# EAGLE design haccess-v1 (EAGLE 6.5.0)
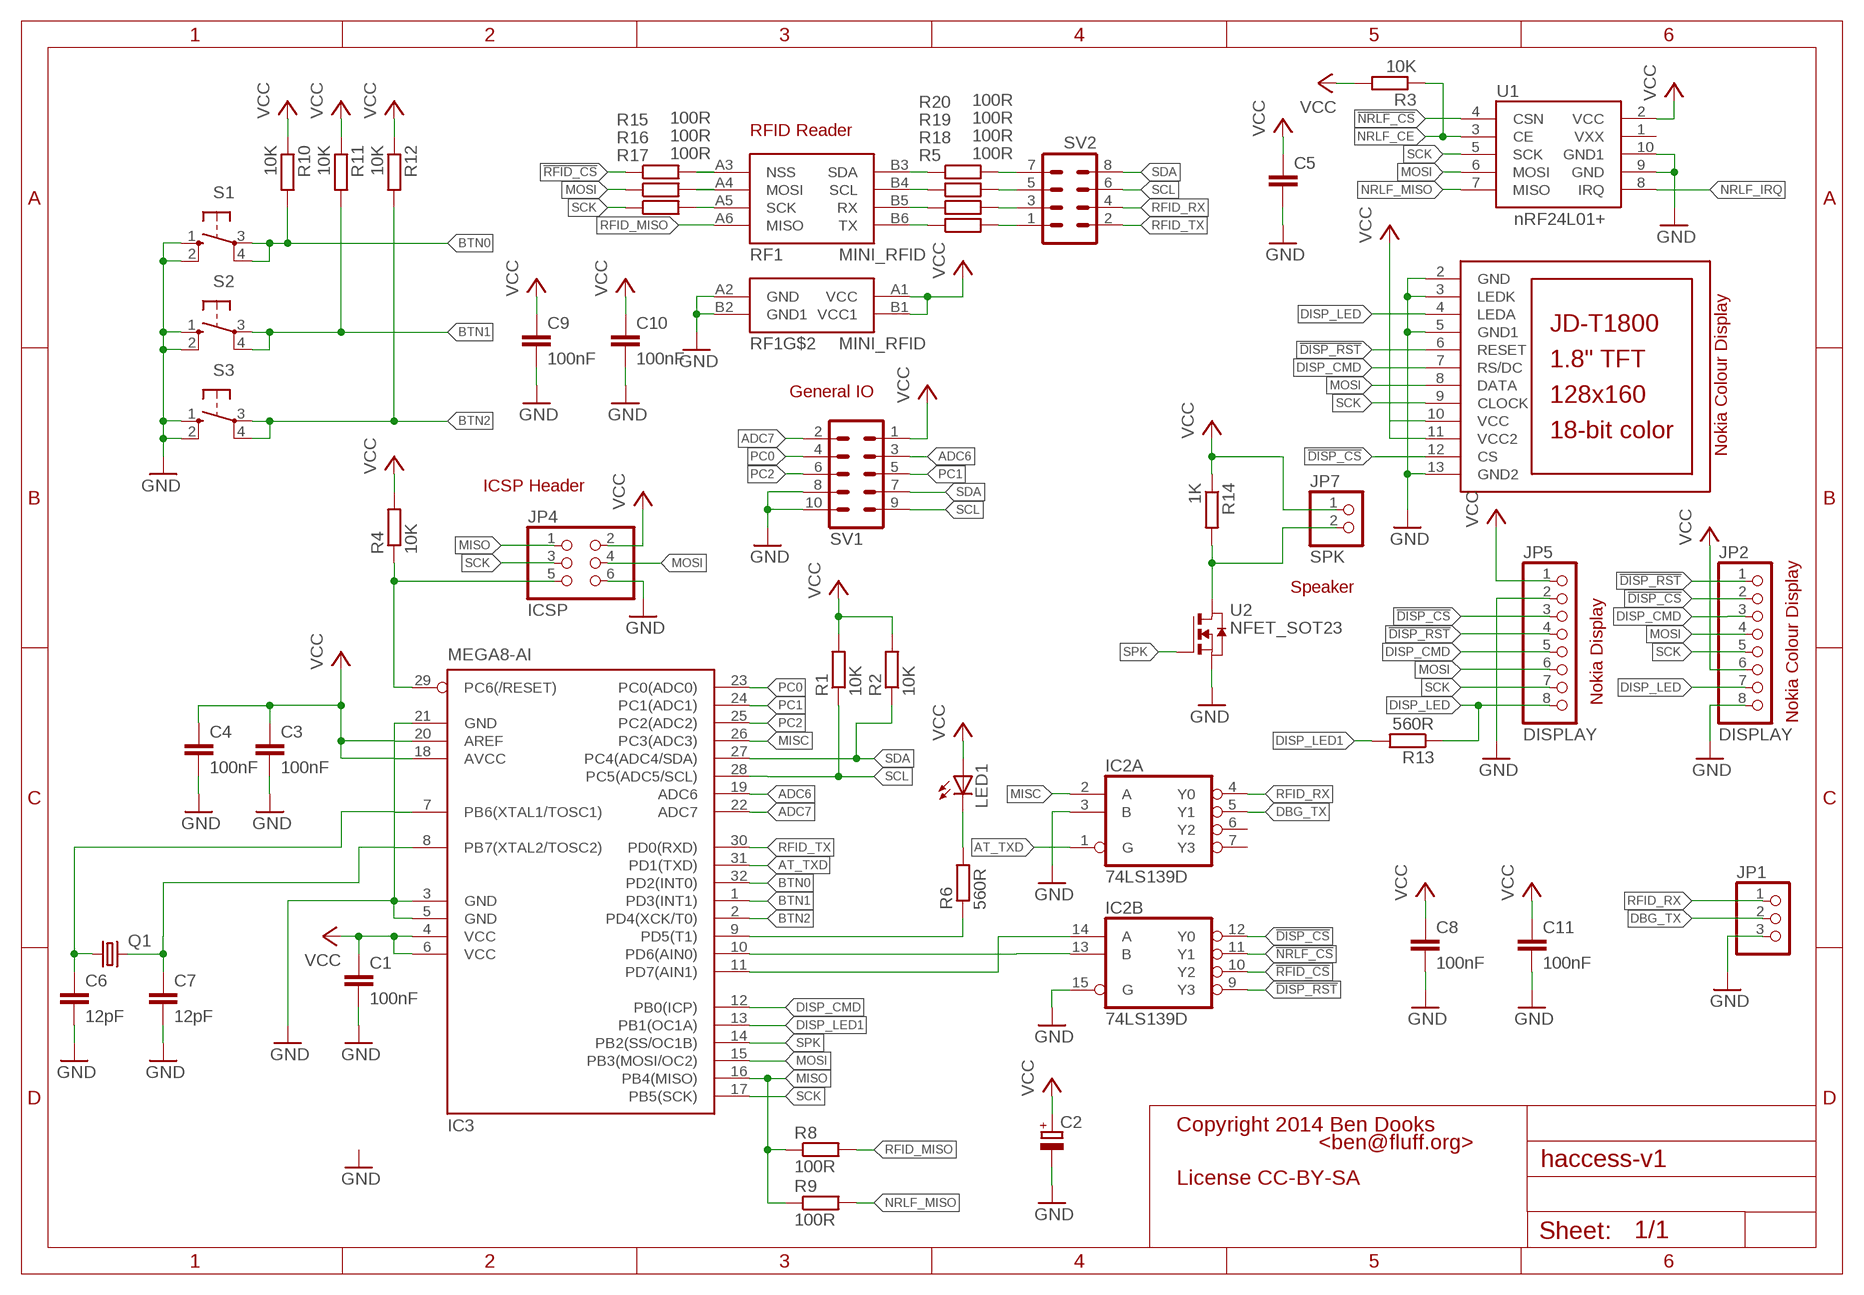
[diagram p0: schematic, sheet 1]

## Parts
C1  100nF  C-EU025-030X050  [C025-030X050]
C2  CPOL-EUE2.5-6  [E2,5-6]
C3  100nF  C-EUC0603K  [C0603K]
C4  100nF  C-EUC0603K  [C0603K]
C5  C-EU025-030X050  [C025-030X050]
C6  12pF  C-EUC0603K  [C0603K]
C7  12pF  C-EUC0603K  [C0603K]
C8  100nF  C-EUC0603K  [C0603K]
C9  100nF  C-EU025-030X050  [C025-030X050]
C10  100nF  C-EU025-030X050  [C025-030X050]
C11  100nF  C-EUC0603K  [C0603K]
IC2  74LS139D  [SO16]
IC3  MEGA8-AI  [TQFP32-08]
JP1  PINHD-1X3  [1X03]
JP2  DISPLAY  PINHD-1X8  [1X08]
JP4  ICSP  PINHD-2X3  [2X03]
JP5  DISPLAY  PINHD-1X8  [1X08]
JP7  SPK  PINHD-1X2  [1X02]
LCD1  JD-T1800  [JD-T1800]
LED1  LED5MM  [LED5MM]
Q1  CRYSTALHC49S  [HC49/S]
R1  10K  R-EU_R0603  [R0603]
R2  10K  R-EU_R0603  [R0603]
R3  10K  R-EU_R0603  [R0603]
R4  10K  R-EU_R0603  [R0603]
R5  100R  R-EU_R0603  [R0603]
R6  560R  R-EU_R0603  [R0603]
R8  100R  R-EU_0204/7  [0204/7]
R9  100R  R-EU_0204/7  [0204/7]
R10  10K  R-EU_R0603  [R0603]
R11  10K  R-EU_R0603  [R0603]
R12  10K  R-EU_R0603  [R0603]
R13  560R  R-EU_0204/7  [0204/7]
R14  1K  R-EU_R0603  [R0603]
R15  100R  R-EU_0207/10  [0207/10]
R16  100R  R-EU_0207/10  [0207/10]
R17  100R  R-EU_0207/7  [0207/7]
R18  100R  R-EU_R0603  [R0603]
R19  100R  R-EU_R0603  [R0603]
R20  100R  R-EU_R0603  [R0603]
RF1  MINI_RFID  [MINI_RFID]
S1  10-XX  [B3F-10XX]
S2  10-XX  [B3F-10XX]
S3  10-XX  [B3F-10XX]
SV1  MA05-2  [MA05-2]
SV2  MA04-2  [MA04-2]
U1  NRF24L01+CHINESE-10PIN  [CHINESE-10PIN]
U2  NFET_SOT23  [SOT23]

## Nets
!DISP_CS: IC2.12(B:Y0) JP2.2 JP5.3 LCD1.12(CS)
!DISP_RST: IC2.9(B:Y3) JP2.1 JP5.4 LCD1.6(RESET)
!NRLF_CS: IC2.11(B:Y1) U1.4(CSN)
!RESET: IC3.29(PC6(/RESET)) JP4.5 R4.1
!RFID_CS: IC2.10(B:Y2) R15.1
ADC6: IC3.19(ADC6) SV1.3
ADC7: IC3.22(ADC7) SV1.2
AT_TXD: IC2.1(A:G) IC3.31(PD1(TXD))
BTN0: IC3.32(PD2(INT0)) R10.2 S1.3(P) S1.4(P1)
BTN1: IC3.1(PD3(INT1)) R11.2 S2.3(P) S2.4(P1)
BTN2: IC3.2(PD4(XCK/T0)) R12.2 S3.3(P) S3.4(P1)
DBG_TX: IC2.5(A:Y1) JP1.2
DISP_CMD: IC3.12(PB0(ICP)) JP2.3 JP5.5 LCD1.7(RS/DC)
DISP_LED: JP2.7 JP5.8 LCD1.4(LEDA) R13.1
DISP_LED1: IC3.13(PB1(OC1A)) R13.2
GND: C1.2 C2.- C3.2 C4.2 C5.2 C6.2 C7.2 C8.2 C9.2 C10.2 C11.2 IC2.3(A:B) IC2.15(B:G) IC3.3(GND) IC3.5(GND) IC3.21(GND) JP1.3 JP2.8 JP4.6 JP5.2 LCD1.2(GND) LCD1.3(LEDK) LCD1.5(GND1) LCD1.13(GND2) RF1.A2(GND) RF1.B2(GND1) S1.1(S) S1.2(S1) S2.1(S) S2.2(S1) S3.1(S) S3.2(S1) SV1.8 SV1.10 U1.9(GND) U1.10(GND1) U2.2(S)
LED: IC3.9(PD5(T1)) R6.1
LED1: LED1.K(C) R6.2
MISC: IC2.2(A:A) IC3.26(PC3(ADC3))
MISO: IC3.16(PB4(MISO)) JP4.1 R8.1 R9.1
MOSI: IC3.15(PB3(MOSI/OC2)) JP2.4 JP4.4 JP5.6 LCD1.8(DATA) R16.1 U1.6(MOSI)
N$1: R17.2 RF1.A5(SCK)
N$2: R16.2 RF1.A4(MOSI)
N$3: R15.2 RF1.A3(NSS)
N$4: R5.1 RF1.B6(TX)
N$8: R18.1 RF1.B5(RX)
N$9: R19.1 RF1.B4(SCL)
N$10: R20.1 RF1.B3(SDA)
N$11: R20.2 SV2.7
N$12: IC2.13(B:B) IC3.10(PD6(AIN0))
N$13: R19.2 SV2.5
N$14: IC2.14(B:A) IC3.11(PD7(AIN1))
N$15: R18.2 SV2.3
N$16: R5.2 SV2.1
NRLF_CE: R3.1 U1.3(CE)
NRLF_IRQ: U1.8(IRQ)
NRLF_MISO: R9.2 U1.7(MISO)
PC0: IC3.23(PC0(ADC0)) SV1.4
PC1: IC3.24(PC1(ADC1)) SV1.5
PC2: IC3.25(PC2(ADC2)) SV1.6
RFID_MISO: R8.2 RF1.A6(MISO)
RFID_RX: IC2.4(A:Y0) JP1.1 SV2.4
RFID_TX: IC3.30(PD0(RXD)) SV2.2
SCK: IC3.17(PB5(SCK)) JP2.5 JP4.3 JP5.7 LCD1.9(CLOCK) R17.1 U1.5(SCK)
SCL: IC3.28(PC5(ADC5/SCL)) R1.1 SV1.9 SV2.6
SDA: IC3.27(PC4(ADC4/SDA)) R2.1 SV1.7 SV2.8
SPK: IC3.14(PB2(SS/OC1B)) U2.1(G)
SPK1: JP7.2 R14.2 U2.3(D)
VCC: C1.1 C2.+ C3.1 C4.1 C5.1 C8.1 C9.1 C10.1 C11.1 IC3.4(VCC) IC3.6(VCC) IC3.18(AVCC) IC3.20(AREF) JP2.6 JP4.2 JP5.1 JP7.1 LCD1.10(VCC) LCD1.11(VCC2) LED1.A R1.2 R2.2 R3.2 R4.2 R10.1 R11.1 R12.1 R14.1 RF1.A1(VCC) RF1.B1(VCC1) SV1.1 U1.2(VCC)
XT1: C6.1 IC3.7(PB6(XTAL1/TOSC1)) Q1.1
XT2: C7.1 IC3.8(PB7(XTAL2/TOSC2)) Q1.2
Unconnected: IC2.6(A:Y2) IC2.7(A:Y3) U1.1(VXX)

## Notes on the sheet
- RFID Reader
- General IO
- Nokia Colour Display
- ICSP Header
- Speaker
- Nokia Display
- Nokia Colour Display
- Copyright 2014 Ben Dooks
- <ben@fluff.org>
- License CC-BY-SA

## Power pins joined to a net without a drawn wire
GND: IC2.8(P:GND)
VCC: IC2.16(P:VCC)

## Library data of the parts
C1 C3-C11 = rcl:C-EU: CAPACITOR, European symbol
C2 = rcl:CPOL-EU: POLARIZED CAPACITOR, European symbol
IC2 = bjd-74us-tssops:74*139: Dual 2-line to 4-line DECODER/DEMULTIPLEXER
IC3 = atmel:MEGA8: MICROCONTROLLER 8 Kbytes FLASH, 1 kbytes SRAM, 512 bytes EEPROM, USART, 6-channel 10 bit ADC, 2-channel 8 bit ADC Pin compatible with Atmega48, ATMega88, ATMega168 Source: avr.lbr; MPN: ATMEGA8-16AU; OC_FARNELL: 9171371; OC_NEWARK: 73M8863
JP1 = adafruit:PINHD-1X3: PIN HEADER
JP2 JP5 = pinhead:PINHD-1X8: PIN HEADER
JP4 = pinhead:PINHD-2X3: PIN HEADER
JP7 = pinhead:PINHD-1X2: PIN HEADER
LCD1 = adafruit:JD-T1800
LED1 = led:LED: LED OSRAM: - CHIPLED LG R971, LG N971, LY N971, LG Q971, LY Q971, LO R971, LY R971 LH N974, LH R974 LS Q976, LO Q976, LY Q976 LO Q996 - Hyper CHIPLED LW Q18S LB Q993, LB Q99A, LB R99A - SideLED LS A670, LO A670, LY A670, LG A670, LP A670 LB A673, LV A673, LT A673, LW A673 LH A674 LY A675 LS A676, LA A676, LO A676, LY A676, LW A676 LS A679, LY A679, LG A679 - Hyper Micro SIDELED® LS Y876, LA Y876, LO Y876, LY Y876 LT Y87S - SmartLED LW L88C, LW L88S LB L89C, LB L89S, LG L890 LS L89K, LO L89K, LY L89K LS L896, LA L896, LO L896, LY L896 - TOPLED LS T670, LO T670, LY T670, LG T670, LP T670 LSG T670, LSP T670, LSY T670, LOP T670, LYG T670 LG T671, LOG T671, LSG T671 LB T673, LV T673, LT T673, LW T673 LH T674 LS T676, LA T676, LO T676, LY T676, LB T676, LH T676, LSB T676, LW T676 LB T67C, LV T67C, LT T67C, LS T67K, LO T67K, LY T67K, LW E67C LS E67B, LA E67B, LO E67B, LY E67B, LB E67C, LV E67C, LT E67C LW T67C LS T679, LY T679, LG T679 LS T770, LO T770, LY T770, LG T770, LP T770 LB T773, LV T773, LT T773, LW T773 LH T774 LS E675, LA E675, LY E675, LS T675 LS T776, LA T776, LO T776, LY T776, LB T776 LHGB T686 LT T68C, LB T68C - Hyper Mini TOPLED® LB M676 - Mini TOPLED Santana® LG M470 LS M47K, LO M47K, LY M47K Source: http://www.osram.convergy.de LUXEON: - LUMILED® LXK2-PW12-R00, LXK2-PW12-S00, LXK2-PW14-U00, LXK2-PW14-V00 LXK2-PM12-R00, LXK2-PM12-S00, LXK2-PM14-U00 LXK2-PE12-Q00, LXK2-PE12-R00, LXK2-PE12-S00, LXK2-PE14-T00, LXK2-PE14-U00 LXK2-PB12-K00, LXK2-PB12-L00, LXK2-PB12-M00, LXK2-PB14-N00, LXK2-PB14-P00, LXK2-PB14-Q00 LXK2-PR12-L00, LXK2-PR12-M00, LXK2-PR14-Q00, LXK2-PR14-R00 LXK2-PD12-Q00, LXK2-PD12-R00, LXK2-PD12-S00 LXK2-PH12-R00, LXK2-PH12-S00 LXK2-PL12-P00, LXK2-PL12-Q00, LXK2-PL12-R00 Source: www.luxeon.com KINGBRIGHT: KA-3528ASYC Source: www.kingbright.com
Q1 = bjd-crystals:CRYSTAL: CRYSTAL
R1-R6 R8-R20 = rcl:R-EU_: RESISTOR, European symbol
RF1 = bjd-mini-rfid:MINI_RFID
S1-S3 = switch-omron:10-XX: OMRON SWITCH; MPN: B3F-1000; OC_FARNELL: 176432; OC_NEWARK: 36M3542
SV1 = con-lstb:MA05-2: PIN HEADER; OC_FARNELL: unknown; OC_NEWARK: unknown
SV2 = con-lstb:MA04-2: PIN HEADER; OC_FARNELL: unknown; OC_NEWARK: unknown
U1 = bjd-nrlf24+:NRF24L01+: When using the DUAL version of this library, make sure to connect VXX to either GND or NC
U2 = bjd-generic-fets:NFET_SOT23

## Board
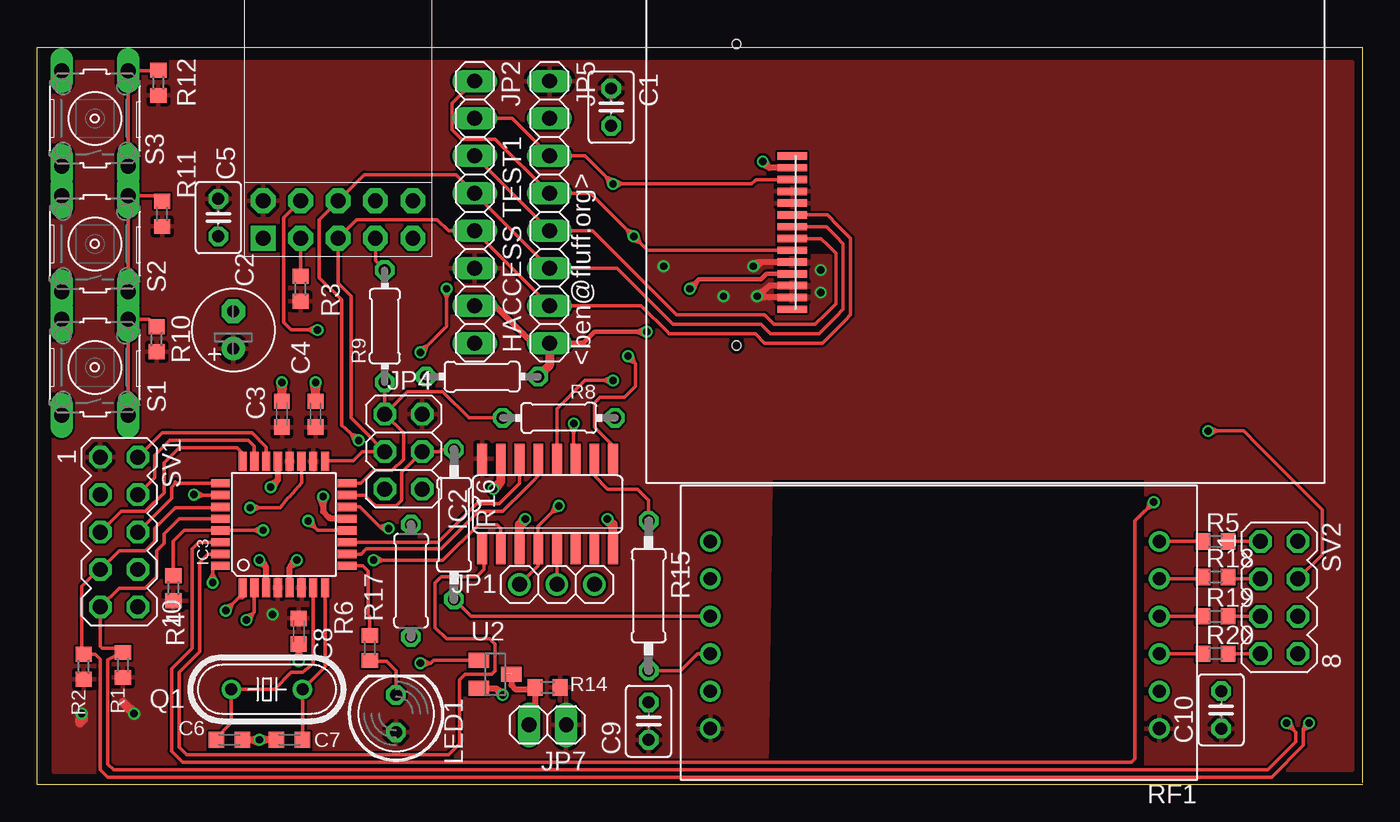
[diagram p1: board, top side]
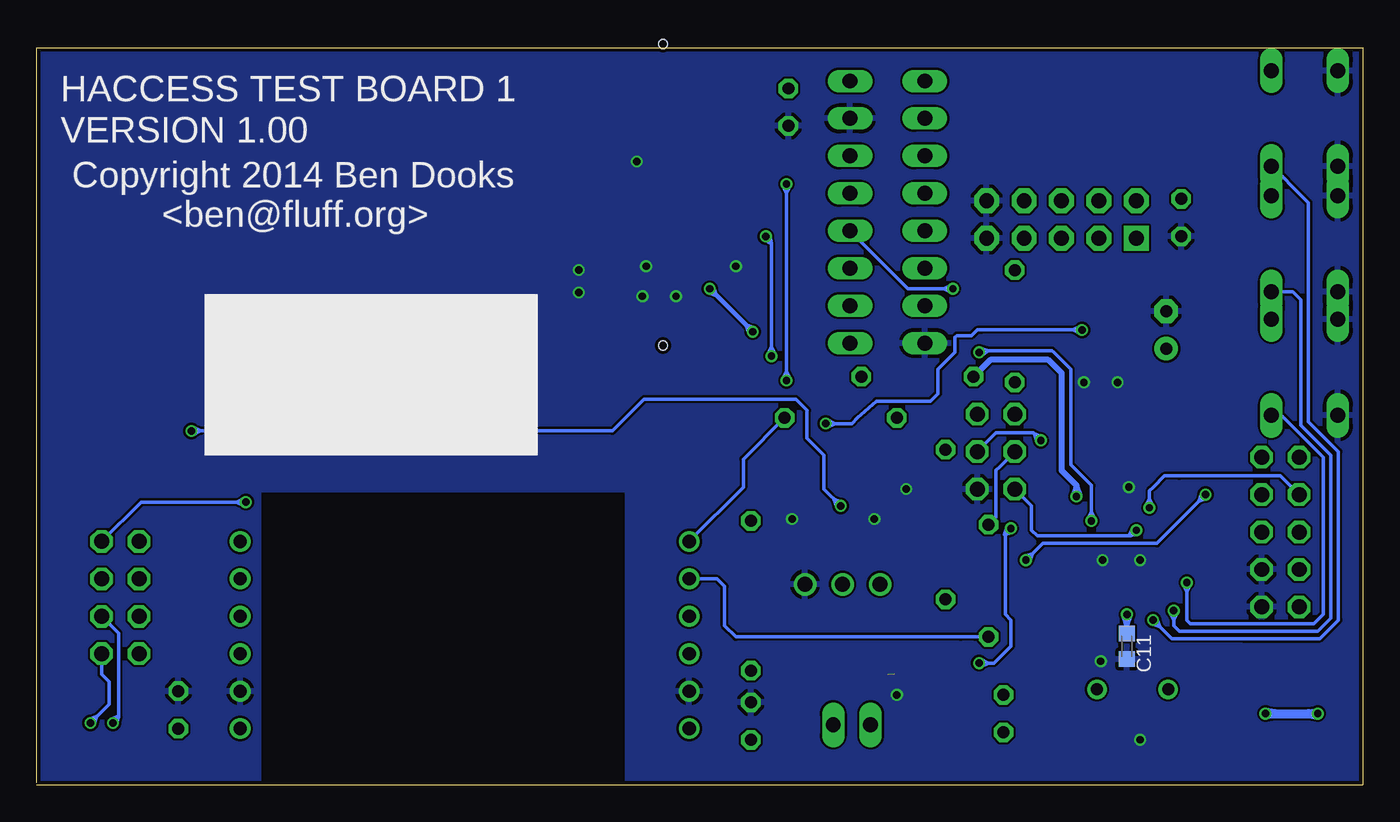
[diagram p2: board, bottom side, seen from below]

Size 90 x 50 mm. Coordinates in mm from the lower left corner, seen from the top.
Outline: 90,0.13 90,50 0,50 0,0 90,0
Copper layers (1*16): Top 0.035mm / dielectric 1.5mm / Bottom 0.035mm
Design rules "Elecrow_2-layer_eagle_rule *": minimum track width 6mil, minimum drill 12mil, track to track 6mil, track to pad 6mil, pad to pad 6mil, via to via 6mil, smd to smd 0mil, copper to edge 10mil, drill to drill 10mil, minimum pad ring 10mil, minimum via ring 6mil, stop-mask expansion 2mil, vias tented up to drill 100mil, thermal gap 10mil

### Footprints (pad centres in the part's own frame; a part is rotated, then mirrored left to right if it is on the bottom)
C025-030X050 = drill 0.813 octagon: 1 -1.27,0; 2 1.27,0
E2,5-6 = drill 0.813 pad 1.6: + -1.27,0 | drill 0.813 pad 1.6 octagon: - 1.27,0
C0603K = smd 1.05 x 1.08: 1 -0.875,0; 2 0.875,0
SO16 = smd 0.66 x 2.032: 1 -4.445,-3.073; 2 -3.175,-3.073; 3 -1.905,-3.073; 4 -0.635,-3.073; 5 0.635,-3.073; 6 1.905,-3.073; 7 3.175,-3.073; 8 4.445,-3.073; 9 4.445,3.073; 10 3.175,3.073; 11 1.905,3.073; 12 0.635,3.073; 13 -0.635,3.073; 14 -1.905,3.073; 15 -3.175,3.073; 16 -4.445,3.073
TQFP32-08 = smd 1.27 x 0.559: 1 -4.293,2.8; 2 -4.293,2; 3 -4.293,1.2; 4 -4.293,0.4; 5 -4.293,-0.4; 6 -4.293,-1.2; 7 -4.293,-2; 8 -4.293,-2.8; 17 4.293,-2.8; 18 4.293,-2; 19 4.293,-1.2; 20 4.293,-0.4; 21 4.293,0.4; 22 4.293,1.2; 23 4.293,2; 24 4.293,2.8 | smd 0.559 x 1.27: 9 -2.8,-4.293; 10 -2,-4.293; 11 -1.2,-4.293; 12 -0.4,-4.293; 13 0.4,-4.293; 14 1.2,-4.293; 15 2,-4.293; 16 2.8,-4.293; 25 2.8,4.293; 26 2,4.293; 27 1.2,4.293; 28 0.4,4.293; 29 -0.4,4.293; 30 -1.2,4.293; 31 -2,4.293; 32 -2.8,4.293
1X03 = drill 1.016: 1 -2.54,0; 2 0,0; 3 2.54,0
1X08 = drill 1.016 long: 1 -8.89,0; 2 -6.35,0; 3 -3.81,0; 4 -1.27,0; 5 1.27,0; 6 3.81,0; 7 6.35,0; 8 8.89,0
2X03 = drill 1.016 octagon: 1 -2.54,-1.27; 2 -2.54,1.27; 3 0,-1.27; 4 0,1.27; 5 2.54,-1.27; 6 2.54,1.27
1X02 = drill 1.016 long: 1 -1.27,0; 2 1.27,0
JD-T1800 = smd 0.5 x 2: 1 5.2,-13.1; 2 4.4,-13.1; 3 3.6,-13.1; 4 2.8,-13.1; 5 2,-13.1; 6 1.2,-13.1; 7 0.4,-13.1; 8 -0.4,-13.1; 9 -1.2,-13.1; 10 -2,-13.1; 11 -2.8,-13.1; 12 -3.6,-13.1; 13 -4.4,-13.1; 14 -5.2,-13.1 | hole 0.6: -12.8,-16.9; 7.65,-16.9
LED5MM = drill 0.813 octagon: A -1.27,0; K 1.27,0
HC49/S = drill 0.813: 1 -2.413,0; 2 2.413,0
R0603 = smd 1 x 1.1: 1 -0.85,0; 2 0.85,0
0204/7 = drill 0.813 octagon: 1 -3.81,0; 2 3.81,0
0207/10 = drill 0.813 octagon: 1 -5.08,0; 2 5.08,0
0207/7 = drill 0.813 octagon: 1 -3.81,0; 2 3.81,0
MINI_RFID = drill 0.9: A1 33.02,16.51; A2 33.02,13.97; A3 33.02,11.43; A4 33.02,8.89; A5 33.02,6.35; A6 33.02,3.81; B1 2.54,16.51; B2 2.54,13.97; B3 2.54,11.43; B4 2.54,8.89; B5 2.54,6.35; B6 2.54,3.81
B3F-10XX = drill 1.016 long: 1 -3.251,2.261; 2 3.251,2.261; 3 -3.251,-2.261; 4 3.251,-2.261
MA05-2 = drill 1.016 octagon: 1 -5.08,-1.27; 2 -5.08,1.27; 3 -2.54,-1.27; 4 -2.54,1.27; 5 0,-1.27; 6 0,1.27; 7 2.54,-1.27; 8 2.54,1.27; 9 5.08,-1.27; 10 5.08,1.27
MA04-2 = drill 1.016 octagon: 1 -3.81,-1.27; 2 -3.81,1.27; 3 -1.27,-1.27; 4 -1.27,1.27; 5 1.27,-1.27; 6 1.27,1.27; 7 3.81,-1.27; 8 3.81,1.27
CHINESE-10PIN = drill 1 pad 1.676 square: 1 -1.27,2.54 | drill 1 pad 1.676 octagon: 2 1.27,2.54; 3 -1.27,0; 4 1.27,0; 5 -1.27,-2.54; 6 1.27,-2.54; 7 -1.27,-5.08; 8 1.27,-5.08; 9 -1.27,-7.62; 10 1.27,-7.62
SOT23 = smd 1 x 1.4: 1 -0.95,-1.1; 2 0.95,-1.1; 3 0,1.1

### Placement (x,y rotation side)
C1  38.99,45.97 270 top
C2  13.34,30.86 90 top
C3  16.64,25.15 90 top
C4  18.92,25.15 90 top
C5  12.32,38.48 270 top
C6  13.08,3.05 0 top
C7  17.14,3.05 180 top
C8  17.78,10.41 270 top
C9  41.53,4.32 90 top
C10  80.39,5.08 90 top
C11  16,9.4 270 bottom
IC2  34.67,19.05 0 top
IC3  16.76,17.65 90 top
JP1  35.31,13.59 0 top
JP2  29.72,38.86 270 top
JP4  24.89,22.61 270 top
JP5  34.8,38.86 270 top
JP7  34.67,4.06 180 top
LCD1  64.39,37.47 270 top
LED1  24.38,4.83 90 top
Q1  15.62,6.48 0 top
R1  5.84,8.13 270 top
R2  3.17,8 270 top
R3  17.91,33.66 270 top
R4  9.27,13.34 270 top
R5  80.01,16.51 0 top
R6  22.61,9.27 270 top
R8  35.43,24.89 0 top
R9  23.62,31.11 90 top
R10  8.13,30.23 90 top
R11  8.51,38.73 90 top
R12  8.26,47.62 90 top
R13  30.23,27.69 180 top
R14  34.67,6.6 180 top
R15  41.53,12.83 270 top
R16  28.32,17.65 270 top
R17  25.4,13.84 270 top
R18  80.01,14.1 0 top
R19  80.01,11.43 0 top
R20  80.01,8.89 0 top
RF1  78.74,20.32 180 top
S1  3.94,28.32 90 top
S2  3.94,36.7 90 top
S3  3.94,45.21 90 top
SV1  5.59,17.14 270 top
SV2  84.33,12.7 270 top
U1  17.91,38.35 90 top
U2  31.11,7.49 270 top

### Tracks (layer width: path | path; a pad name or v marks a point on that pad's centre or on a via)
!DISP_CS  (via drill 0.5)
  Top 0.254: JP2.2 32.26,45.21 JP5.3 37.21,42.67 38.73,41.15 v39.12,40.77 | v39.12,40.77 39.62,40.77 | 39.62,40.77 48.51,40.77 48.77,41.02 48.85,41.06 LCD1.12 | v39.12,40.77 39.62,40.77 | IC2.12 35.31,25.53 37.21,27.43 v39.12,27.43 | v39.12,27.43 38.99,27.18 38.49,27.43 38.99,27.68 v39.12,27.43 | v39.12,40.77 38.85,40.68 38.67,41.21 39.2,41.03 v39.12,40.77 | v39.12,40.77 39.24,41.01 39.74,40.77 39.24,40.52 v39.12,40.77
  Bottom 0.254: v39.12,27.43 v39.12,40.77 | v39.12,27.43 38.87,27.55 39.12,28.06 39.36,27.55 v39.12,27.43 | v39.12,40.77 39.36,40.65 39.12,40.14 38.87,40.65 v39.12,40.77
!DISP_RST  (via drill 0.5)
  Top 0.254: LCD1.6 41.46,36.27 v40.51,37.21 | v40.51,37.21 37.59,40.13 JP5.4 31.11,43.81 28.83,43.81 28.19,44.45 28.19,46.23 JP2.1 | IC2.9 39.12,22.99 38.35,23.75 37.85,24.26 37.85,25.91 38.23,26.29 39.88,26.29 40.64,27.05 40.64,28.57 v40.13,29.08 | v40.13,29.08 40.39,29.17 40.57,28.64 40.04,28.82 v40.13,29.08 | v40.51,37.21 40.77,37.3 40.95,36.77 40.42,36.95 v40.51,37.21 | v40.51,37.21 40.25,37.12 40.07,37.65 40.6,37.47 v40.51,37.21
  Bottom 0.254: v40.13,29.08 40.13,29.46 40.13,36.2 40.13,36.7 v40.51,37.21 | v40.13,29.08 39.88,29.2 40.13,29.71 40.38,29.2 v40.13,29.08 | v40.51,37.21 40.64,36.97 40.14,36.71 40.24,37.26 v40.51,37.21
!NRLF_CS  (via drill 0.5)
  Top 0.254: U1.4 16.76,38.48 16.76,31.37 17.27,30.86 v19.05,30.86 | IC2.11 36.58,22.99 36.45,23.11 36.45,23.5 v36.45,24.51 | v19.05,30.86 18.93,30.61 18.43,30.86 18.93,31.11 v19.05,30.86 | v36.45,24.51 36.7,24.39 36.45,23.89 36.2,24.39 v36.45,24.51
  Bottom 0.254: v19.05,30.86 25.91,30.86 26.16,30.86 26.29,30.73 26.54,30.48 27.56,30.48 27.69,30.35 27.69,29.34 28.83,28.19 28.83,26.92 28.83,26.54 29.34,26.04 33.02,26.04 34.29,24.89 34.67,24.51 v36.45,24.51 | v19.05,30.86 19.17,31.11 19.68,30.86 19.17,30.61 v19.05,30.86 | v36.45,24.51 36.33,24.26 35.82,24.51 36.33,24.76 v36.45,24.51
!RESET  (via drill 0.5)
  Top 0.254: v15.37,17.27 14.61,17.27 14.59,17.25 IC3.29 10.01,17.25 9.27,16.51 R4.1 | v15.37,17.27 15.25,17.02 14.74,17.27 15.25,17.52 v15.37,17.27
  Bottom 0.254: JP4.5 22.48,18.92 22.48,17.27 22.1,16.89 15.75,16.89 v15.37,17.27 | v15.37,17.27 15.61,17.39 15.86,16.89 15.31,17 v15.37,17.27
!RFID_CS
  Top 0.254: IC2.10 37.85,20.95 38.73,20.07 40.26,20.07 40.77,20.07 41.02,19.81 41.53,19.3 R15.1
ADC6  (via drill 0.5)
  Top 0.254: IC3.19 17.96,20.5 17.14,19.56 17.02,19.43 16.51,18.8 v14.48,18.8 | v14.48,18.8 14.6,19.04 15.1,18.8 14.6,18.55 v14.48,18.8
  Bottom 0.254: SV1.3 5.46,20.83 5.59,20.95 12.45,20.95 13.46,20.95 14.22,20.19 14.48,19.94 v14.48,18.8 | v14.48,18.8 14.23,18.92 14.48,19.42 14.72,18.92 v14.48,18.8
ADC7
  Top 0.254: IC3.22 15.56,22.92 14.61,23.88 9.14,23.88 8.51,23.88 SV1.2
AT_TXD
  Top 0.254: IC3.31 11.59,15.65 11.05,15.11 11.05,9.02 9.65,7.62 9.65,2.54 10.16,2.03 22.23,2.03 22.99,2.03 27.94,2.03 28.7,2.79 28.7,7.11 29.08,7.49 30.86,7.49 31.11,7.75 31.11,9.53 30.73,9.91 27.81,9.91 27.05,10.67 27.05,13.72 27.43,14.1 29.84,14.1 30.35,14.61 30.35,15.85 IC2.1
BTN0  (via drill 0.5)
  Top 0.254: R10.2 7.63,31.57 S1.4 S1.3 | v11.94,13.72 11.94,14.7 IC3.32 | v11.94,13.72 11.69,13.84 11.94,14.34 12.19,13.84 v11.94,13.72
  Bottom 0.254: S1.3 5.51,25.07 2.67,22.23 2.67,11.56 3.3,10.92 11.68,10.92 11.94,11.18 11.94,13.46 v11.94,13.72 | v11.94,13.72 12.19,13.6 11.94,13.09 11.69,13.6 v11.94,13.72
BTN1  (via drill 0.5)
  Top 0.254: R11.2 8.14,39.95 S2.4 S2.3 | v12.83,11.81 13.72,12.7 13.97,12.7 14.1,12.83 14.1,13.23 IC3.1 | v12.83,11.81 12.74,12.07 13.27,12.25 13.09,11.72 v12.83,11.81
  Bottom 0.254: S2.3 4.75,33.45 4.19,32.89 4.19,24.38 2.16,22.35 2.16,11.3 3.05,10.41 12.45,10.41 12.83,10.79 v12.83,11.81 | v12.83,11.81 13.07,11.69 12.83,11.19 12.58,11.69 v12.83,11.81
BTN2  (via drill 0.5)
  Top 0.254: R12.2 8.24,48.46 S3.4 S3.3 | IC3.2 14.76,11.72 14.35,11.3 v14.22,11.18 | v14.22,11.18 14.13,11.44 14.67,11.62 14.48,11.09 v14.22,11.18
  Bottom 0.254: v14.22,11.18 13.59,10.54 12.95,9.91 11.56,9.91 8.13,9.91 2.92,9.91 1.65,11.18 1.65,22.61 3.68,24.64 3.68,39.5 4.06,39.88 6.15,41.96 S3.3 | v14.22,11.18 14.31,10.91 13.78,10.73 13.96,11.27 v14.22,11.18
DBG_TX
  Top 0.254: IC2.5 JP1.2
DISP_CMD  (via drill 0.5)
  Top 0.254: JP2.3 JP5.5 37.72,37.59 43.43,31.88 49.15,31.88 49.4,31.88 49.78,31.5 50.04,31.24 52.83,31.24 53.59,32 54.23,32.64 54.23,36.07 54.1,36.2 53.59,36.7 53.34,36.96 53.23,37.06 LCD1.7 | IC3.12 19.07,17.25 18.67,17.65 v18.41,17.91 | v26.04,29.34 26.42,29.72 27.81,31.11 v27.81,33.66 | v18.41,17.91 18.68,18 18.86,17.46 18.33,17.65 v18.41,17.91 | v26.04,29.34 25.95,29.6 26.48,29.78 26.3,29.25 v26.04,29.34 | v27.81,33.66 28.06,33.53 27.81,33.03 27.57,33.53 v27.81,33.66
  Bottom 0.254: v18.41,17.91 18.41,20.32 19.81,21.72 19.81,28.19 20.95,29.34 21.08,29.46 25.65,29.46 v26.04,29.34 | v27.81,33.66 30.86,33.66 JP5.5 | v18.41,17.91 18.17,18.03 18.41,18.53 18.66,18.03 v18.41,17.91 | v26.04,29.34 25.87,29.12 25.42,29.46 25.97,29.6 v26.04,29.34 | v27.81,33.66 27.93,33.9 28.44,33.66 27.93,33.41 v27.81,33.66
DISP_LED  (via drill 0.5)
  Top 0.305: LCD1.4 49.52,34.66 49.4,34.54 49.15,34.29 44.96,34.29 v44.32,33.66 | v41.4,30.73 37.85,30.73 37.08,29.97 | v44.32,33.66 44.23,33.89 44.77,34.1 44.56,33.56 v44.32,33.66 | v41.4,30.73 41.3,30.5 40.78,30.73 41.3,30.96 v41.4,30.73
  Top 0.406: JP2.7 31.11,32.51 33.02,30.61 33.66,29.97 JP5.8 37.08,29.97
  Top 0.61: JP5.8 34.8,28.45 R13.1
  Bottom 0.305: v44.32,33.66 43.56,32.89 v41.4,30.73 | v44.32,33.66 44.41,33.42 43.88,33.21 44.09,33.75 v44.32,33.66 | v41.4,30.73 41.31,30.97 41.84,31.18 41.63,30.64 v41.4,30.73
DISP_LED1  (via drill 0.5)
  Top 0.406: v19.43,19.56 19.43,18.54 19.81,18.16 19.92,18.05 IC3.13 | v19.43,19.56 19.62,19.5 19.43,18.93 19.24,19.5 v19.43,19.56
  Bottom 0.406: v19.43,19.56 19.43,20.32 19.81,20.7 20.45,21.34 20.45,27.94 21.34,28.83 25.27,28.83 25.65,28.45 R13.2 | v19.43,19.56 19.24,19.62 19.43,20.18 19.62,19.62 v19.43,19.56
GND  (via drill 0.5)
  Top 0.406: IC3.3 15.56,14.79 v15.11,15.24 | IC3.5 17.16,14.75 v17.65,15.24 | IC3.21 16.36,20.68 v15.88,20.19 | U2.2 31.18,6.54 v31.62,6.1 | C6.2 v15.11,3.05 | C7.2 v15.11,3.05 | LCD1.13 49.7,41.87 v49.28,42.29 | LCD1.5 48.93,35.47 v48.64,35.18 | LCD1.3 49.74,33.87 v48.9,33.15 | LCD1.2 49.74,33.06 v48.9,33.15 | C8.2 v17.78,8.38 | v15.11,15.24 15.29,15.33 15.55,14.8 15.02,15.06 v15.11,15.24 | v17.65,15.24 17.74,15.06 17.21,14.8 17.48,15.33 v17.65,15.24 | v15.88,20.19 15.79,20.37 16.32,20.64 16.05,20.1 v15.88,20.19 | v31.62,6.1 31.45,6.01 31.18,6.54 31.71,6.27 v31.62,6.1 | v15.11,3.05 15.05,2.86 14.49,3.05 15.05,3.24 v15.11,3.05 | v15.11,3.05 15.18,3.24 15.74,3.05 15.18,2.86 v15.11,3.05 | v49.28,42.29 49.45,42.39 49.73,41.87 49.19,42.11 v49.28,42.29 | v48.64,35.18 48.61,35.38 49.2,35.47 48.78,35.04 v48.64,35.18 | v48.9,33.15 48.82,33.33 49.37,33.55 49.07,33.04 v48.9,33.15 | v48.9,33.15 48.98,33.33 49.52,33.09 48.94,32.95 v48.9,33.15 | v17.78,8.38 17.59,8.45 17.78,9.01 17.97,8.45 v17.78,8.38
  Top 0.61: C3.2 v16.64,27.3 | C4.2 v18.92,27.3 | IC2.3 32.77,17.65 v33.15,18.03 | IC2.15 31.5,20.57 v30.99,20.07 | IC2.8 39.12,17.65 v38.73,18.03 | v16.64,27.3 16.73,27.29 16.64,26.68 16.54,27.29 v16.64,27.3 | v18.92,27.3 19.02,27.29 18.92,26.68 18.83,27.29 v18.92,27.3 | v33.15,18.03 33.21,17.96 32.77,17.54 33.06,18.08 v33.15,18.03 | v30.99,20.07 30.93,20.14 31.43,20.51 31.07,20.01 v30.99,20.07 | v38.73,18.03 38.82,18.08 39.12,17.54 38.67,17.96 v38.73,18.03
  other vias: 46.61,33.15 42.55,35.18 53.21,34.92 53.21,33.4
  pour Bottom: -0.25,50.16 92.84,50.16 92.33,-1.02 74.93,-1.14 74.93,20.07 49.91,20.07 49.91,0 0,0
  pour Top: 41.66,35.81 53.85,35.81 53.85,31.37 41.66,31.37
LED
  Top 0.254: IC3.9 22.1,14.85 22.48,14.48 22.48,11.56 22.61,11.43 R6.1
LED1
  Top 0.254: LED1.K 24.38,7.75 23.75,8.38 22.64,8.38 R6.2
MISC  (via drill 0.5)
  Top 0.254: IC3.26 10.7,19.65 v10.67,19.68 | v22.86,15.24 27.56,15.24 29.97,17.65 31.24,17.65 31.5,17.4 IC2.2 | v10.67,19.68 10.8,19.93 11.29,19.65 10.78,19.43 v10.67,19.68 | v22.86,15.24 22.98,15.49 23.48,15.24 22.98,14.99 v22.86,15.24
  Bottom 0.254: v10.67,19.68 11.05,19.3 13.97,16.38 21.72,16.38 v22.86,15.24 | v10.67,19.68 10.93,19.77 11.11,19.24 10.58,19.42 v10.67,19.68 | v22.86,15.24 22.6,15.15 22.42,15.68 22.95,15.5 v22.86,15.24
MISO
  Top 0.254: IC3.16 21.98,20.45 22.86,21.34 24.13,21.34 24.89,22.1 24.89,23.88 JP4.1 | JP4.1 R9.1 | R8.1 29.34,24.89 27.56,26.67 25.15,26.67 JP4.1
MOSI  (via drill 0.5)
  Top 0.254: LCD1.8 53.58,37.87 53.59,37.85 54.23,37.21 54.74,36.7 54.74,32.26 54.23,31.75 53.09,30.61 49.78,30.61 49.15,31.24 48.77,31.24 43.18,31.24 39.37,35.05 JP5.6 JP2.4 28.45,41.4 22.23,41.4 U1.6 19.18,38.35 19.18,34.42 20.7,32.89 20.7,24.38 v21.84,23.37 | R16.1 27.43,22.73 27.3,22.61 JP4.4 24.77,21.21 24.77,19.3 24.64,19.18 24.38,18.92 22.99,18.92 22.73,19.18 22.26,19.65 IC3.15 | v21.84,23.37 21.59,23.26 21.38,23.78 21.92,23.63 v21.84,23.37
  Bottom 0.254: JP4.4 25.27,23.5 24.89,23.88 22.35,23.88 v21.84,23.37 | v21.84,23.37 21.75,23.63 22.29,23.81 22.11,23.28 v21.84,23.37
N$1
  Bottom 0.254: R17.2 26.29,10.03 27.3,10.03 42.55,10.03 43.31,10.79 43.31,13.46 43.81,13.97 RF1.A5
N$2
  Top 0.254: RF1.A4 29.46,11.43 R16.2
N$3
  Top 0.254: RF1.A3 44.83,8.89 43.69,7.75 R15.2
N$4
  Top 0.254: RF1.B6 79.03,16.51 R5.1
N$8
  Top 0.254: RF1.B5 79.03,13.97 R18.1
N$9
  Top 0.254: RF1.B4 R19.1
N$10
  Top 0.254: RF1.B3 R20.1
N$11
  Top 0.254: R20.2 SV2.7
N$12
  Top 0.254: IC3.10 22,15.65 22.35,16 27.43,16 29.34,17.91 29.97,18.54 31.62,18.54 33.15,20.07 33.27,20.19 33.4,20.32 33.66,20.57 34.04,20.95 34.04,21.34 IC2.13
N$13
  Top 0.254: R19.2 SV2.5
N$14
  Top 0.254: IC3.11 27.25,16.45 29.84,19.05 31.37,19.05 32.64,20.32 32.77,20.45 IC2.14
N$15
  Top 0.254: SV2.3 80.99,13.97 R18.2
N$16
  Top 0.254: SV2.1 R5.2
NRLF_CE
  Top 0.254: U1.3 R3.1
NRLF_MISO
  Top 0.254: U1.7 22.99,35.56 R9.2
PC0
  Top 0.254: IC3.23 14.76,22.95 14.35,23.37 9.02,23.37 8.76,23.11 8,22.35 8,20.83 SV1.4
PC1
  Top 0.254: IC3.24 13.96,22.48 13.58,22.86 9.65,22.86 8.64,21.84 8.64,19.81 7.37,18.54 5.71,18.54 SV1.5
PC2
  Top 0.254: IC3.25 9.52,20.45 | 9.52,20.45 9.4,20.57 | 9.52,20.45 9.4,20.45 9.14,20.19 9.14,19.43 SV1.6
RFID_MISO
  Bottom 0.254: R8.2 42.04,22.1 42.04,20.19 RF1.A6
RFID_RX  (via drill 0.5)
  Top 0.254: JP1.1 34.04,14.86 IC2.4 34.04,17.53 35.05,18.54 v35.43,18.92 | v79.5,24 81.92,24 82.93,22.99 85.98,19.94 87.25,18.67 87.25,15.62 SV2.4 | v79.5,24 79.62,24.25 80.13,24 79.62,23.76 v79.5,24 | v35.43,18.92 35.52,18.66 34.99,18.48 35.17,19.01 v35.43,18.92
  Bottom 0.254: v79.5,24 50.93,24 48.77,26.16 38.48,26.16 37.72,25.4 37.72,23.5 36.58,22.35 36.58,20.07 36.07,19.56 35.94,19.43 v35.43,18.92 | v79.5,24 79.38,23.76 78.88,24 79.38,24.25 v79.5,24 | v35.43,18.92 35.34,19.18 35.88,19.36 35.69,18.83 v35.43,18.92
RFID_TX  (via drill 0.5)
  Top 0.254: IC3.30 10.99,16.45 10.54,16 10.54,15.11 10.54,14.48 10.54,9.27 9.14,7.87 9.14,2.29 9.91,1.52 74.17,1.52 74.3,1.52 74.55,1.78 74.55,17.91 75.44,18.8 | 74.8,18.16 75.06,18.41 75.44,18.8 | 75.44,18.8 v75.82,19.18 | 75.38,18.73 75.91,18.92 | v75.82,19.18 75.91,18.92 | 75.38,18.73 75.56,19.27 | v75.82,19.18 75.56,19.27 | 75.38,18.73 75.91,18.92 | v75.82,19.18 75.91,18.92 | 75.38,18.73 75.56,19.27 | v75.82,19.18 75.56,19.27
  Bottom 0.254: v75.82,19.18 82.93,19.18 SV2.2 | v75.82,19.18 75.94,19.42 76.44,19.18 75.94,18.93 v75.82,19.18
SCK
  Top 0.254: LCD1.9 53.66,38.66 54.36,37.97 54.86,37.47 55.24,37.08 55.24,31.88 54.86,31.5 53.34,29.97 49.4,29.97 48.77,30.61 48.51,30.61 42.93,30.61 42.8,30.73 41.02,32.51 JP5.7 JP2.5 27.94,37.59 27.18,38.35 27.05,38.35 26.54,38.35 26.29,38.35 21.72,38.35 U1.5 20.45,34.04 21.34,33.15 21.34,30.48 21.34,29.08 21.34,28.83 21.34,24.89 22.23,24 JP4.3 22.1,22.61 21.46,21.97 19.59,21.97 IC3.17
  Bottom 0.254: JP4.3 24.64,21.59 24.89,21.34 24.89,18.16 R17.1
SCL  (via drill 0.5)
  Top 0.254: IC3.28 12.45,18.03 9.65,18.03 9.53,17.91 8.64,17.02 8.64,16.38 8.13,15.88 8.13,14.1 7.37,13.34 5.59,13.34 SV1.9 4.32,9.99 4.32,9.4 4.45,9.27 5.55,9.27 R1.1 4.83,8.47 4.83,1.4 5.21,1.02 83.57,1.02 85.47,2.92 85.47,3.56 v84.84,4.19 | v84.84,4.19 85.1,4.28 85.28,3.75 84.75,3.93 v84.84,4.19
  Bottom 0.254: v84.84,4.19 84.45,4.57 84.45,10.29 SV2.6 | v84.84,4.19 84.57,4.14 84.45,4.69 84.96,4.44 v84.84,4.19
SDA  (via drill 0.5)
  Top 0.254: IC3.27 12.41,18.8 9.4,18.8 8,17.4 8,16.51 7.37,15.88 5.59,15.88 5.46,15.75 SV1.7 4.19,14.61 3.05,13.46 3.05,8.98 R2.1 3.98,8.85 4.32,8.51 4.32,1.02 4.83,0.51 83.82,0.51 85.98,2.67 85.98,3.81 v86.36,4.19 | v86.36,4.19 86.48,3.94 85.98,3.7 86.09,4.25 v86.36,4.19
  Bottom 0.254: v86.36,4.19 85.6,4.95 85.09,5.46 85.09,6.99 85.6,7.49 SV2.8 | v86.36,4.19 86.1,4.1 85.92,4.63 86.45,4.45 v86.36,4.19
SPK  (via drill 0.5)
  Top 0.254: U2.1 26.92,8.44 26.73,8.26 v26.04,8.26 | IC3.14 21.91,18.85 22.99,17.78 23.24,17.53 23.37,17.4 v23.88,17.4 | v23.88,17.4 23.71,17.18 23.26,17.51 23.8,17.66 v23.88,17.4 | v26.04,8.26 26.16,8.5 26.66,8.26 26.16,8.01 v26.04,8.26
  Bottom 0.254: v26.04,8.26 25.78,8.26 25.02,8.26 24.26,9.02 23.88,9.4 23.88,11.05 23.88,11.18 24.26,11.56 24.26,12.45 24.26,16.89 v23.88,17.4 | v23.88,17.4 24.14,17.49 24.32,16.96 23.79,17.14 v23.88,17.4 | v26.04,8.26 25.91,8.01 25.41,8.26 25.91,8.5 v26.04,8.26
SPK1  (1 unrouted)
  Top 0.406: 31.79,7.53 31.75,7.49 | U2.3 32.22,6.77 32.51,6.48 33.69,6.48 R14.2 33.82,5.5 33.78,5.46 33.4,5.08 JP7.2
VCC  (via drill 0.5)
  Top 0.61: 5.84,5.59 v6.6,4.83 | v3.05,4.83 3.17,4.45 2.92,4.19 2.92,4.32 | v6.6,4.83 6.53,4.77 6.16,5.27 6.66,4.91 v6.6,4.83 | v3.05,4.83 3.14,4.79 2.94,4.21 2.95,4.83 v3.05,4.83 | v3.05,4.83 3.14,4.79 2.92,4.21 2.95,4.83 v3.05,4.83
  Bottom 0.406: C11.1 v16,11.56 | v16,11.56 16.19,11.49 16,10.93 15.81,11.49 v16,11.56
  Bottom 0.61: v6.6,4.83 v3.05,4.83 | v6.6,4.83 6.59,4.73 5.98,4.83 6.59,4.92 v6.6,4.83 | v3.05,4.83 3.06,4.92 3.67,4.83 3.06,4.73 v3.05,4.83
  pour Top (rank 2): 1.14,49.02 89.28,49.02 89.28,1.02 75.31,1.02 75.31,20.83 49.78,20.83 49.78,20.57 49.53,0.89 1.14,0.89
XT1
  Top 0.254: IC3.7 18.76,8.22 18.03,7.62 17.27,7.62 16.13,6.48 Q1.1 13.21,4.19 12.06,3.05 12.06,3.42 C6.1
XT2
  Top 0.254: IC3.8 19.56,8.01 Q1.2 18.03,3.06 C7.1

### Text on the board
tNames: HACCESS TEST1 | <ben@fluff.org>
bNames: HACCESS TEST BOARD 1 | VERSION 1.00 | Copyright 2014 Ben Dooks | <ben@fluff.org>